# Altium schematic sheet bqZUM_USB.SchDoc: USB Serial Port
size A4; Date: 20140214; Author: bq; CompanyName: bq - Mundo Reader; Organization: bq - Mundo Reader; DocumentNumber: 6; Revision: 3; SheetNumber: 6; SheetTotal: 8
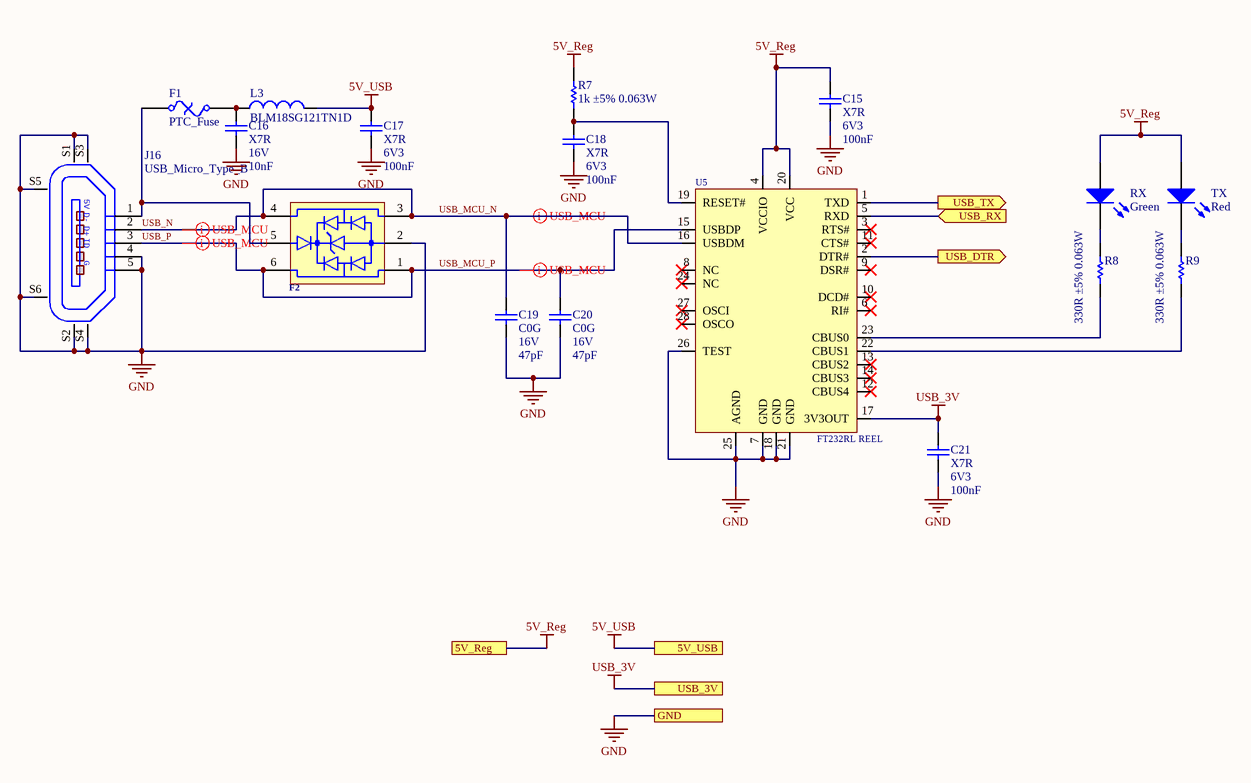
[diagram p0: bqZUM_USB.SchDoc]

## Parts
C15  Dielectric: X7R  Voltage: 6V3  Capacitance: 100nF  [C0402]  (hidden comment: Capacitor)
C16  Dielectric: X7R  Voltage: 16V  Capacitance: 10nF  [C0402]  (hidden comment: Capacitor)
C17  Dielectric: X7R  Voltage: 6V3  Capacitance: 100nF  [C0402]  (hidden comment: Capacitor)
C18  Dielectric: X7R  Voltage: 6V3  Capacitance: 100nF  [C0402]  (hidden comment: Capacitor)
C19  Dielectric: C0G  Voltage: 16V  Capacitance: 47pF  [C0402]  (hidden comment: Capacitor)
C20  Dielectric: C0G  Voltage: 16V  Capacitance: 47pF  [C0402]  (hidden comment: Capacitor)
C21  Dielectric: X7R  Voltage: 6V3  Capacitance: 100nF  [C0402]  (hidden comment: Capacitor)
F1  PTC_Fuse  [F1812]
F2  ESDUSB  [SOT563]  (value not drawn)
J16  USB_Micro_Type_B  [USB_Micro_B]
L3  BLM18SG121TN1D  [L0603]
R7  value 1k ±5% 0.063W  [R0402]  (hidden comment: Resistor)
R8  value 330R ±5% 0.063W  [R0402]  (hidden comment: Resistor)
R9  value 330R ±5% 0.063W  [R0402]  (hidden comment: Resistor)
RX  Green  [LED0603]
TX  Red  [LED0603]
U5  FT232RL REEL  [SSOP28]

## Ports
5V_Reg, 5V_USB, GND, USB_3V, USB_DTR (out), USB_RX (in), USB_TX (out)

## Nets
5V_Reg: C15.2 R7.2 RX.A TX.A U5.4(VCCIO) U5.20(VCC) ; port 5V_Reg
5V_USB: C17.2 L3.2 ; port 5V_USB
GND: C15.1 C16.1 C17.1 C18.1 C19.1 C20.1 C21.2 F2.2 J16.4(P4) J16.5(P5) J16.S1(SHLD1) J16.S2(SHLD2) J16.S3(SHLD3) J16.S4(SHLD4) J16.S5(SHLD5) J16.S6(SHLD6) U5.7(GND) U5.18(GND) U5.21(GND) U5.25(AGND) U5.26(TEST) ; port GND
USB_3V: C21.1 U5.17(3V3OUT) ; port USB_3V
USB_DTR: U5.2(DTR#) ; port USB_DTR
USB_MCU_N: C19.2 F2.3 F2.4 J16.2(P2) U5.16(USBDM)  [also labelled USB_N]
USB_MCU_P: C20.2 F2.1 F2.6 J16.3(P3) U5.15(USBDP)  [also labelled USB_P]
USB_RX: U5.5(RXD) ; port USB_RX
USB_TX: U5.1(TXD) ; port USB_TX
NetC16_2: C16.2 F1.2 L3.1
NetC18_2: C18.2 R7.1 U5.19(RESET#)
NetF1_1: F1.1 F2.5 J16.1(P1)
NetR8_1: R8.1 U5.23(CBUS0)
NetR8_2: R8.2 RX.K
NetR9_1: R9.1 U5.22(CBUS1)
NetR9_2: R9.2 TX.K

Not connected (* = marked no-connect by the designer): U5 3(RTS#)* 6(RI#)* 8(NC)* 9(DSR#)* 10(DCD#)* 11(CTS#)* 12(CBUS4)* 13(CBUS2)* 14(CBUS3)* 24(NC)* 27(OSCI)* 28(OSCO)*

## Layout directives
differential pair: USB_MCU_N, USB_MCU_P

## Notes on the sheet
- Title
- Project
- Size:
- Author
- A4
- Number:
- Revision:
- Date:
- Time:
- Sheet
- of
- (in symbol Micro USB Type B SMD) 5V; D-; D+; ID; G

## Library data of the parts
C15 C17 C18 C21 = C0402_100nF_6V3_±10%: Manufacturer: Kemet; Value: 100nF ±10% 6V3; Tolerance: ±10%; OrderingCode: C0402C104K9RAC; Temp_ Max: 125; Temp_ Min: -55; Part Number: C0402_100nF_6V3_±10%
C16 = C0402_10nF_16V_±10%: Manufacturer: Kemet; Value: 10nF ±10% 16V; Tolerance: ±10%; OrderingCode: C0402C103K4RAC; Temp_ Max: 125; Temp_ Min: -55; Part Number: C0402_10nF_16V_±10%
C19 C20 = C0402_47pF_16V_±10%: Manufacturer: Kemet; Value: 47pF ±10% 16V; Tolerance: ±10%; OrderingCode: C0402C470K4GAC; Temp_ Max: 125; Temp_ Min: -55; Part Number: C0402_47pF_16V_±10%
F1 = FUSE 0.5A 15V: PTC Resettable Fuse; Manufacturer: Bourns; Voltage: 15V; Current: 0.5A; OrderingCode: MF-MSMF050-2; Temp_ Max: 85; Temp_ Min: -40; Part Number: FUSE 0.5A 15V
F2 = USB ESD Single: USB ESD Protection; Manufacturer: Würth; OrderingCode: 82400152; Temp_ Max: 125; Temp_ Min: -40; Part Number: USB ESD Single; Supplier: Würth
J16 = Micro USB Type B SMD: USB Micro B; Manufacturer: Hirose Connector; OrderingCode: ZX62-B-5PA-11; Temp_ Max: 85; Temp_ Min: -30; Part Number: Micro USB Type B SMD
L3 = L0603_120R_0,025R_3000mA: Manufacturer: Murata; Resistance_100MHz: 120R; Resistance_DC: 0,025R; Current: 3000mA; Temp_ Max: 125; Temp_ Min: -55; Value: 120R 0,025R 3000mA; Part Number: L0603_120R_0,025R_3000mA; OrderingCode: BLM18SG121TN1D
R7 = R0402_1k_0.063W_±5%: Manufacturer: Vishay; Tolerance: ±5%; OrderingCode: CRCW04021K00JN; Power: 0.063W; Resistance: 1k; Temp_ Max: 155; Temp_ Min: -55; PackageDescription: SMD; Part Number: R0402_1k_0.063W_±5%
R8 R9 = R0402_330R_0.063W_±5%: Manufacturer: Vishay; Tolerance: ±5%; OrderingCode: CRCW0402330RJN; Power: 0.063W; Resistance: 330R; Temp_ Max: 155; Temp_ Min: -55; PackageDescription: SMD; Part Number: R0402_330R_0.063W_±5%
RX = HSMG-C190: Light Emitting Diode; Manufacturer: Avago Technologies; Temp_ Max: 85; Temp_ Min: -40; Part Number: HSMG-C190; OrderingCode: HSMG-C190; Value: Green
TX = HSMH-C190: Light Emitting Diode; Manufacturer: Avago Technologies; Temp_ Max: 85; Temp_ Min: -40; Part Number: HSMH-C190; OrderingCode: HSMH-C190; Value: Red
U5 = FT232RL: IC USB TO SERIAL UART 28-SSOP; Manufacturer: FTDI; Temp_ Max: 85; Temp_ Min: -40; Part Number: FT232RL; OrderingCode: FT232RL REEL